# EAGLE design Sparki_Senseboard (EAGLE 6.3)
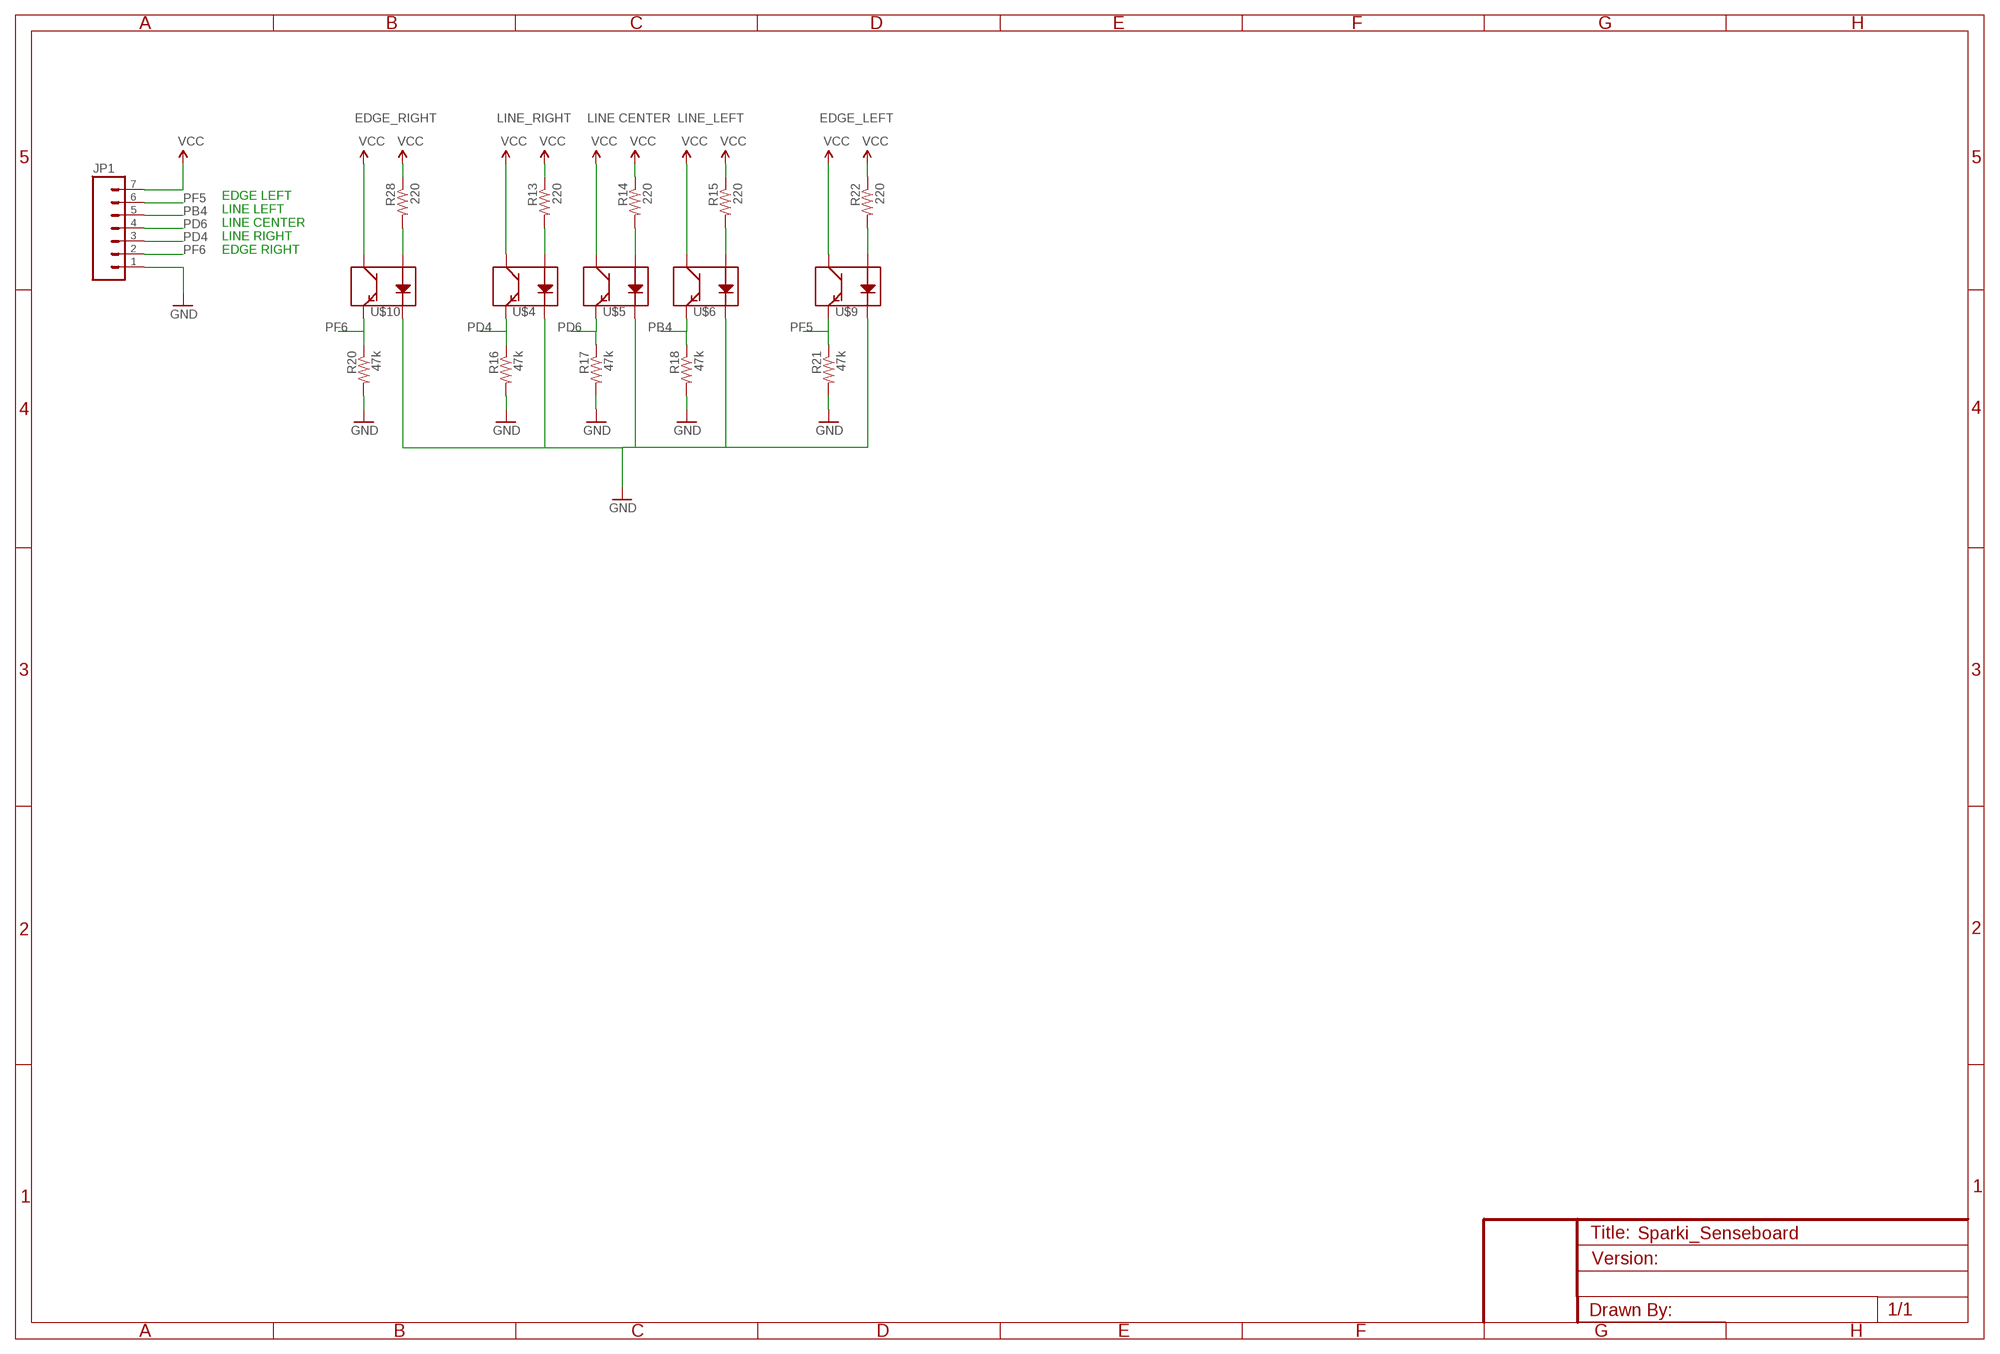
[diagram p0: schematic, sheet 1]

## Parts
JP1  M07  [1X07]
R13  220  RESISTOR0603-RES  [0603-RES]
R14  220  RESISTOR0603-RES  [0603-RES]
R15  220  RESISTOR0603-RES  [0603-RES]
R16  47k  RESISTOR0603-RES  [0603-RES]
R17  47k  RESISTOR0603-RES  [0603-RES]
R18  47k  RESISTOR0603-RES  [0603-RES]
R20  47k  RESISTOR0603-RES  [0603-RES]
R21  47k  RESISTOR0603-RES  [0603-RES]
R22  220  RESISTOR0603-RES  [0603-RES]
R28  220  RESISTOR0603-RES  [0603-RES]
U$4  LINE_RIGHT  QRE1113  [QRE1113]
U$5  LINE CENTER  QRE1113  [QRE1113]
U$6  LINE_LEFT  QRE1113  [QRE1113]
U$9  EDGE_LEFT  QRE1113  [QRE1113]
U$10  EDGE_RIGHT  QRE1113  [QRE1113]

## Nets
GND: JP1.1 R16.2 R17.2 R18.2 R20.2 R21.2 U$4.2(K) U$5.2(K) U$6.2(K) U$9.2(K) U$10.2(K)
LINEFLEDLEFT: R13.2 U$4.1(A)
LINEFLEDMID: R14.2 U$5.1(A)
LINEFLEDRIGHT: R15.2 U$6.1(A)
N$1: R28.2 U$10.1(A)
N$28: R22.2 U$9.1(A)
PB4: JP1.5 R18.1 U$6.4(E)
PD4: JP1.3 R16.1 U$4.4(E)
PD6: JP1.4 R17.1 U$5.4(E)
PF5: JP1.6 R21.1 U$9.4(E)
PF6: JP1.2 R20.1 U$10.4(E)
VCC: JP1.7 R13.1 R14.1 R15.1 R22.1 R28.1 U$4.3(C) U$5.3(C) U$6.3(C) U$9.3(C) U$10.3(C)

## Notes on the sheet
- EDGE LEFT
  LINE LEFT
  LINE CENTER
  LINE RIGHT
  EDGE RIGHT

## Library data of the parts
JP1 = SparkFun-Connectors:M07: Header 7 Standard 7-pin 0.1" header. Use with straight break away headers (SKU : PRT-00116), right angle break away headers (PRT-00553), swiss pins (PRT-00743), machine pins (PRT-00117), and female headers (PRT-00115). NOTES ON THE VARIANTS LOCK and LOCK_LONGPADS... This footprint was designed to help hold the alignment of a through-hole component (i.e. 7-pin header) while soldering it into place. You may notice that each hole has been shifted either up or down by 0.005 of an inch from it's more standard position (which is usually a perfectly straight line). This slight alteration caused the pins (the squares in the middle) to touch the edges of the holes. Because they are alternating, it causes a "brace" to hold the header in place. 0.005 has proven to be the perfect amount of "off-center" position when using our standard breakaway headers. Although looks a little odd when you look at the bare footprint, once you have a header in there, the alteration is very hard to notice. Also, if you push a header all the way into place, it is covered up entirely on the bottom side. This idea of altering the position of holes to aid alignment will be further integrated into the Sparkfun Library for other footprints. It can help hold any component with 3 or more connection pins.
R13-R18 R20-R22 R28 = SparkFun-Passives:RESISTOR: Resistor Basic schematic elements and footprints for 0603, 1206, and PTH resistors.
U$4-U$6 U$9 U$10 = SparkFun-Sensors:QRE1113: Reflective object sensor

## Board
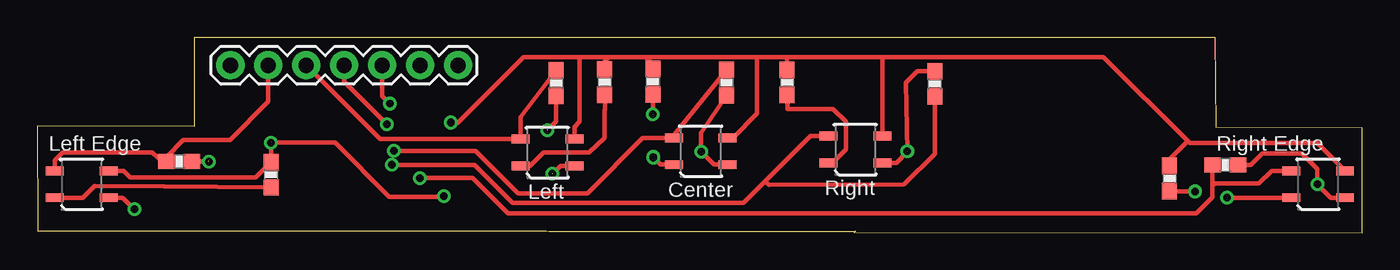
[diagram p1: board, top side]
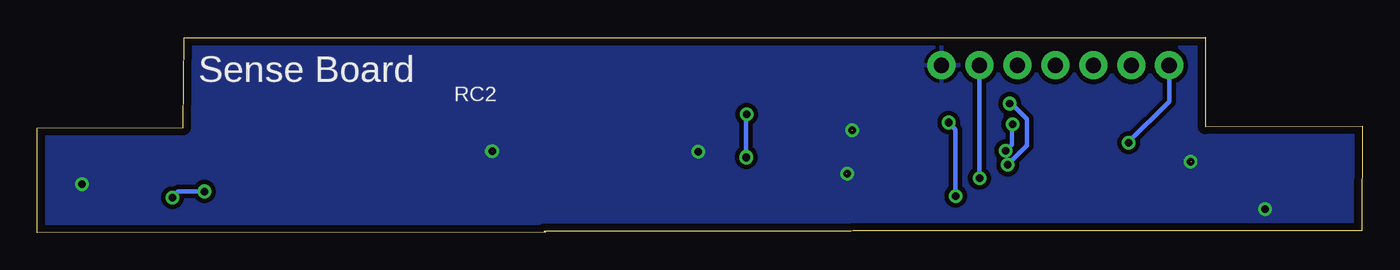
[diagram p2: board, bottom side, seen from below]

Size 88.72 x 13.11 mm. Coordinates in mm from the lower left corner, seen from the top.
Outline: 10.52,13.11 10.52,7.14 0,7.16 0.03,0.13 34.11,0.13 34.24,0.1 54.79,0.08 54.69,0.03 88.72,0 88.72,7.04 78.94,7.06 78.89,13.08 10.54,13.08
Copper layers (1+16): Top 0.0178mm / dielectric 59mil / Bottom 0.0178mm
Design rules "China": minimum track width 10mil, minimum drill 14mil, track to track 12mil, track to pad 12mil, pad to pad 10mil, via to via 12mil, smd to smd 6mil, copper to edge 20mil, drill to drill 16mil, minimum pad ring 8mil, minimum via ring 8mil, stop-mask expansion 3mil, vias tented up to drill 25mil, thermal gap 10mil

### Footprints (pad centres in the part's own frame; a part is rotated, then mirrored left to right if it is on the bottom)
1X07 = drill 1.016 pad 1.88: 1 0,0; 2 2.54,0; 3 5.08,0; 4 7.62,0; 5 10.16,0; 6 12.7,0; 7 15.24,0
0603-RES = smd 1.1 x 1: 1 -0.85,0; 2 0.85,0
QRE1113 = smd 1.2 x 0.6: 1 -1.8,-0.9; 2 1.8,-0.9; 3 1.8,0.9; 4 -1.8,0.9

### Placement (x,y rotation side)
JP1  28.17,11.23 180 top
R13  50.22,10.08 270 top
R14  41.22,10.13 270 top
R15  38,10.11 270 top
R16  60.1,9.98 90 top
R17  46.15,10.06 270 top
R18  34.75,10.03 270 top
R20  79.55,4.55 0 top
R21  9.5,4.78 0 top
R22  15.65,3.89 270 top
R28  75.82,3.63 270 top
U$4  54.79,5.59 0 top
U$5  44.42,5.46 0 top
U$6  34.16,5.38 0 top
U$9  2.97,3.25 0 top
U$10  85.78,3.25 0 top

### Tracks (layer width: path | path; a pad name or v marks a point on that pad's centre or on a via)
GND  (via drill 0.5)  (4 unrouted)
  Top 0.305: U$9.2 5.73,2.35 v6.5,1.57 | R21.2 11.46,4.78 | R20.2 81.28,4.55 82.04,5.31 84.68,5.31 85.72,4.27 v85.72,3.25 86.62,2.35 U$10.2 | U$4.2 57.52,4.69 58.27,5.44 58.17,10.06 58.94,10.83 R16.2 | U$5.2 45.33,4.56 v44.45,5.44 44.45,6.69 R17.2 | R18.2 34.72,7.44 34.16,6.88 | U$6.2 35.04,4.48 34.49,3.94
  other vias: 58.27,5.46 11.48,4.78 34.14,6.88 34.49,3.96
  pour Bottom: -0.48,16.33 90.53,17.09 90.35,-6.78 -1.19,-7.32 -1.27,15.7
LINEFLEDLEFT
  Top 0.305: U$4.1 53.25,4.69 54.15,5.59 54.15,7.44 53.29,8.31 50.23,8.31 R13.2
LINEFLEDMID  (via drill 0.5)  (1 unrouted)
  Top 0.305: U$5.1 41.72,4.56 v41.25,5.03 | R14.2 41.22,7.95
  Bottom 0.305: v41.25,5.03 41.25,7.92 41.22,7.95
LINEFLEDRIGHT
  Top 0.305: U$6.1 33.01,4.48 33.91,5.38 36.96,5.38 38,6.35 38,8.23 38.02,8.25 38.02,9.23 R15.2
N$1  (via drill 0.5)  (1 unrouted)
  Top 0.305: U$10.1 79.72,2.35 79.71,2.36 | R28.2 77.51,2.78 v77.52,2.77
  Bottom 0.305: v77.52,2.77 79.3,2.77 79.71,2.36
N$2  (via drill 0.5)
  other vias: 27.69,7.39
N$3  (via drill 0.5)
  other vias: 79.68,2.36
N$4  (via drill 0.5)
  other vias: 41.25,5.08
N$5  (via drill 0.5)
  other vias: 41.22,7.95
N$28
  Top 0.305: U$9.1 3.04,2.33 3.84,3.12 8.5,3.1 R22.2
PB4
  Top 0.305: JP1.5 22.95,6.28 U$6.4 32.36,7.76 R18.1
PD4  (via drill 0.5)
  Top 0.305: JP1.3 23.09,9.17 v23.6,8.66 | v23.75,4.55 29.29,4.55 31.83,2.01 47.3,2.01 48.74,3.45 | 48.74,3.45 51.77,6.48 52.98,6.48 U$4.4 | R16.1 60.1,5.28 58.04,3.23 48.98,3.21 48.74,3.45
  Bottom 0.305: v23.6,8.66 23.5,8.66 22.45,7.62 22.45,5.84 v23.75,4.55
PD6  (via drill 0.5)  (1 unrouted)
  Top 0.305: JP1.4 20.55,10.13 v23.42,7.26 23.44,7.24 | v23.88,5.49 29.34,5.49 32.18,2.64 36.83,2.64 40.54,6.35 42.61,6.35 U$5.4 42.62,6.57 R17.1
  Bottom 0.305: 23.44,7.24 23.44,5.92 v23.88,5.49
PF5
  Top 0.305: U$9.4 1.17,4.83 1.7,5.38 7.7,5.38 8.36,4.78 R21.1 8.65,5.09 9.78,6.22 12.9,6.22 15.47,8.79 JP1.6
PF6  (via drill 0.5)
  Top 0.305: v25.63,3.66 29.16,3.66 31.52,1.3 77.62,1.3 78.69,2.36 78.69,3.12 | 78.69,3.12 78.69,4.53 R20.1 | U$10.4 82.66,4.15 81.81,3.3 78.87,3.3 78.69,3.12
  Bottom 0.305: JP1.2 v25.63,3.66
VCC  (via drill 0.5)  (1 unrouted)
  Top 0.305: U$9.3 5.78,4.15 6.22,3.71 14.62,3.71 R22.1 v15.65,6.05 | v15.65,6.05 15.65,6.07 | v15.65,6.05 19.94,6.05 23.57,2.41 27.18,2.41 v27.23,2.46 | v27.69,7.37 28.14,7.37 32.56,11.79 36.17,11.79 | 36.17,11.79 38.28,11.79 | 38.28,11.79 40.72,11.79 | 40.72,11.79 48.21,11.79 | 48.21,11.79 50.17,11.79 | 50.17,11.79 56.44,11.79 | 56.44,11.79 71.4,11.79 77.04,6.15 | 77.04,6.15 77.17,6.02 85.71,6.02 U$10.3 | R28.1 75.82,4.93 77.04,6.15 | U$5.3 46.6,6.36 48.21,7.98 48.21,11.79 | R13.1 50.22,11.73 50.17,11.79 | U$4.3 56.59,11.64 56.44,11.79 | R14.1 41.17,11.33 40.72,11.79 | R15.1 38.02,11.53 38.28,11.79 | U$6.3 35.96,7.08 36.32,7.44 36.32,11.63 36.17,11.79
  Bottom 0.305: JP1.7 12.93,8.79 15.65,6.07 | v27.23,2.46 27.23,6.91 v27.69,7.37

### Text on the board
tPlace: Left Edge | Right Edge | Left | Center | Right
bPlace: Sense Board | RC2